# Altium schematic sheet Console.SchDoc: NH Speaker Sensor 16CH 2.3_C
size A3; Revision: 2.3; SheetNumber: 5; SheetTotal: 6
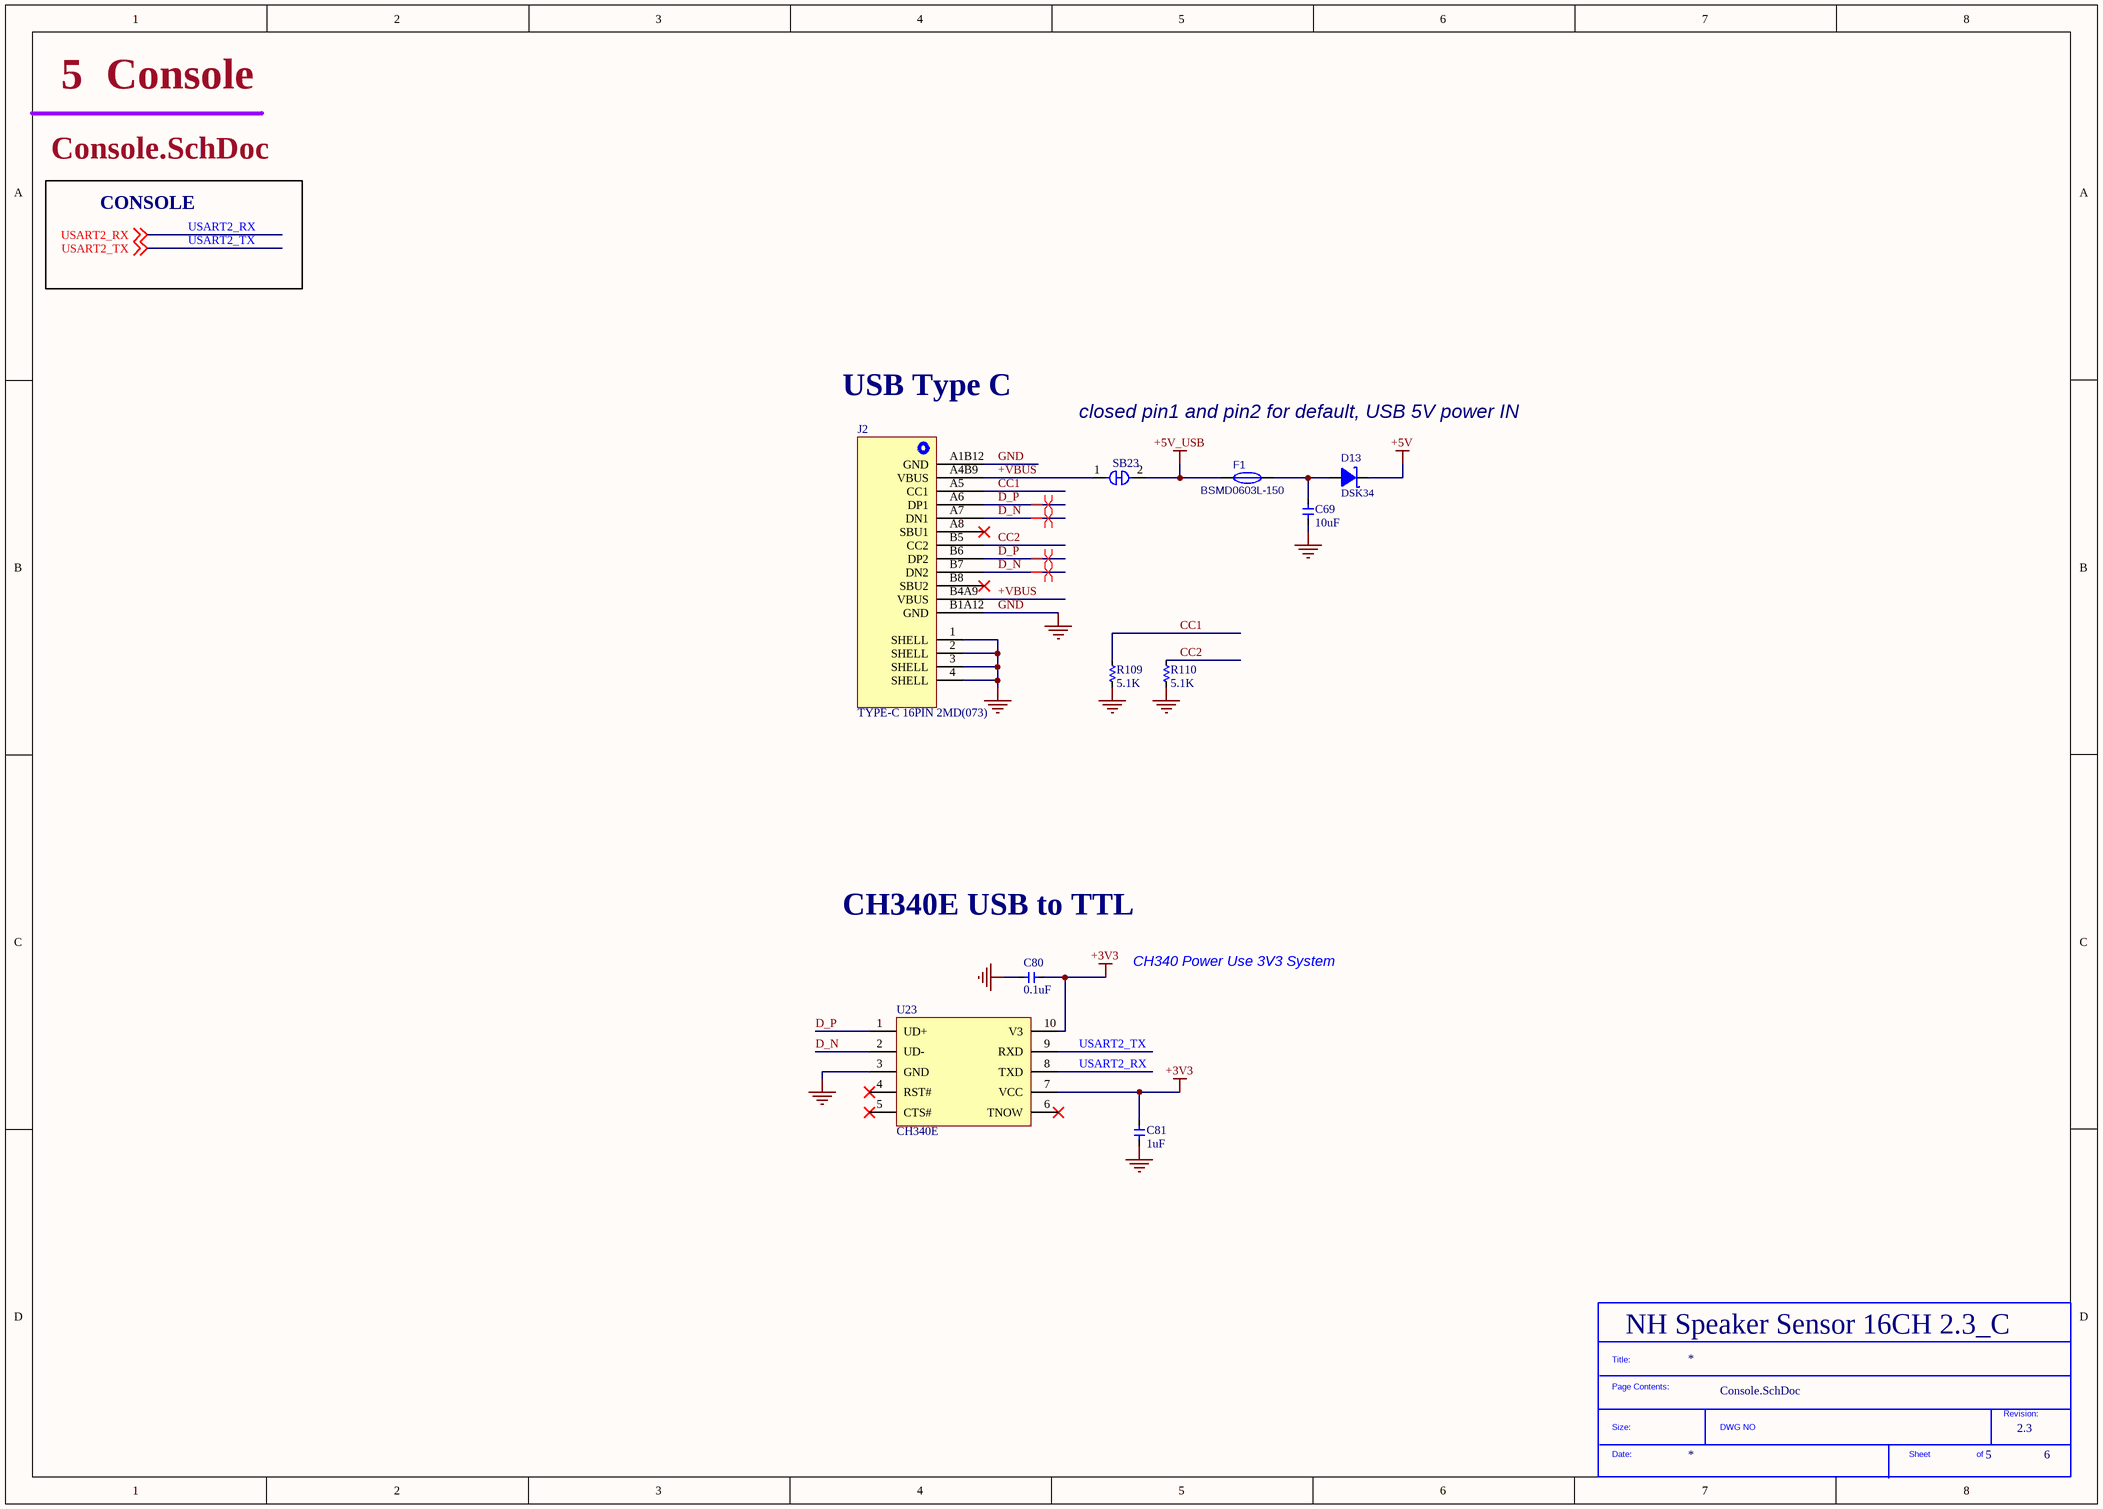
[diagram p0: Console.SchDoc]

## Parts
*?  SDTitleBlock  (value not drawn)  (graphical)
C69  10uF  [C_0603]
C80  0.1uF  [C_0603]
C81  1uF  [C_0603]
D13  DSK34  [SOD-123_L2.8-W1.8-LS3.7-RD]
F1  BSMD0603L-150  [F0603]
J2  TYPE-C 16PIN 2MD(073)  [USB-C-SMD_TYPE-C16PIN]
R109  5.1K  [R_0603]
R110  5.1K  [R_0603]
SB23  SOLDERJUMPER_1WAY_ON  [SOLDERJUMPER_1WAY_ON]  (value not drawn)  (no BOM)
U23  CH340E  [MSOP-10_L3.0-W3.0-P0.50-LS5.0-BL]

## Nets
+3V3: C80.1 C81.2 U23.7(VCC) U23.10(V3)
+5V: D13.1(A)
+5V_USB: F1.1 SB23.2
GND: C69.1 C80.2 C81.1 J2.1(SHELL) J2.2(SHELL) J2.3(SHELL) J2.4(SHELL) J2.A1B12(GND) J2.B1A12(GND) R109.2 R110.2 U23.3(GND)
+VBUS: J2.A4B9(VBUS) J2.B4A9(VBUS) SB23.1
CC1: J2.A5(CC1) R109.1
CC2: J2.B5(CC2) R110.1
D_N: J2.A7(DN1) J2.B7(DN2) U23.2(UD-)
D_P: J2.A6(DP1) J2.B6(DP2) U23.1(UD+)
USART2_RX: U23.8(TXD) ; off-sheet USART2_RX
USART2_TX: U23.9(RXD) ; off-sheet USART2_TX
NetC69_2: C69.2 D13.2(K) F1.2

Not connected (* = marked no-connect by the designer): J2 A8(SBU1)* B8(SBU2)*; U23 4(RST#)* 5(CTS#)* 6(TNOW)*

## Layout directives
differential pair: D_N, D_P

## Notes on the sheet
- Console
- CONSOLE
- USB Type C
- closed pin1 and pin2 for default, USB 5V power IN
- CH340E USB to TTL
- CH340 Power Use 3V3 System
- (in symbol SDTitleBlock) Title:; Page Contents:; Revision:; Size:; DWG NO; Date:; Sheet; of

## Library data of the parts
*? = SDTitleBlock: TitleBlock
C69 = CL10A106KP8NNNC: 10uF 10V 0603 Multilayer Ceramic Capacitors MLCC - SMD/SMT ROHS; Manufacturer: Samsung Electro-Mechanics; Manufacturer Part Number: CL10A106KP8NNNC; Package: 0603; LCSC Part Number: C19702; ComponentLink1Description: Digikey Link; ComponentLink1URL: https://www.digikey.com/en/products/detail/samsung-electro-mechanics/CL10A105KB8NNNC/3887518?s=N4IgTCBcDaIMIBkCMAGAgqgrAaQEIA4A5YuEAXQF8g; ComponentLink2Description: LCSC Link; ComponentLink2URL: https://jlcpcb.com/parts/componentSearch?searchTxt=10k%200603; Assembly Type: SMT Assembly
C80 = CC0603KRX7R9BB104: 100NF 50V 0603 ROHS; Manufacturer: YAGEO; Manufacturer Part Number: CC0603KRX7R9BB104; Package: 0603; LCSC Part Number: C14663; ComponentLink1Description: Digikey Link; ComponentLink1URL: https://www.digikey.com/en/products/detail/yageo/CC0603KRX7R9BB104/2103082?s=N4IgTCBcDaIMwEYEFoFwCzuWZA5AIiALoC%2BQA; ComponentLink2Description: LCSC Link; ComponentLink2URL: https://jlcpcb.com/parts/componentSearch?searchTxt=10k%200603; Assembly type: SMT Assembly
C81 = CL10A105KB8NNNC: 1UF 50V 0603 ROHS; Manufacturer: Samsung Electro-Mechanics; Manufacturer Part Number: CL10A105KB8NNNC; Package: 0603; LCSC Part Number: C15849; ComponentLink1Description: Digikey Link; ComponentLink1URL: https://www.digikey.com/en/products/detail/samsung-electro-mechanics/CL10A105KB8NNNC/3887518?s=N4IgTCBcDaIMIBkCMAGAgqgrAaQEIA4A5YuEAXQF8g; ComponentLink2Description: LCSC Link; ComponentLink2URL: https://jlcpcb.com/parts/componentSearch?searchTxt=10k%200603; Assembly Type: SMT Assembly
D13 = DSK34: DSK34 40V 550mV@3A 3A SOD-123 Schottky Barrier Diodes (SBD) ROHS Copy; Manufacturer: MDD（Microdiode Electronics); Package: SOD-123; Manufacturer Part Number: DSK34; LCSC Part Number: C41029; Assembly Type: SMT Assembly
F1 = BSMD0603L-150: 6V 1.5A 50A 1W -40℃~+85℃ 3A 5mΩ 500ms 55mΩ 0603; Manufacturer: BHFUSE; LCSC Part Number: C914094; Manufacturer Part Number: BSMD0603L-150; Package: 0603; Assembly Type: SMT Assembly
J2 = TYPE-C 16PIN 2MD(073): 5A 1 Surface Mount 16 Female -25℃~+85℃ Type-C SMD USB Connectors ROHS; Manufacturer: SHOU HAN; Manufacturer Part Number: TYPE-C16PIN; Package: SMD; Assembly Type: SMT Assembly; LCSC Part Number: C2765186
R109 R110 = 0603WAF5101T5E: 5.1K 5.1kΩ 0603 1/10W Thick Film Resistors 75V ±1% ±100ppm/℃ -55℃~+155℃ Chip Resistor - Surface Mount ROHS; Manufacturer: Uniroyal Elec; Manufacturer Part Number: 0603WAF5101T5E; LCSC Part Number: C23186; Package: 0603; Assembly Type: SMT Assembly
SB23 = SOLDERJUMPER_1WAY_ON: GateName_1: G$1; SymbolName_1: SOLDERJUMPER_1WAY; LibraryName: microbuilder; DeviceSetName: SOLDERJUMPER_1WAY
U23 = CH340E: Transceiver USB 2.0 2Mbps MSOP-10 USB ICs RoHS; Manufacturer: WCH(Jiangsu Qin Heng); Manufacturer Part: CH340E; LCSC Part: C99652; Package: MSOP-10; Assembly Type: SMT Assembly